# EAGLE schematic wristwatch (EAGLE 6.5.0)
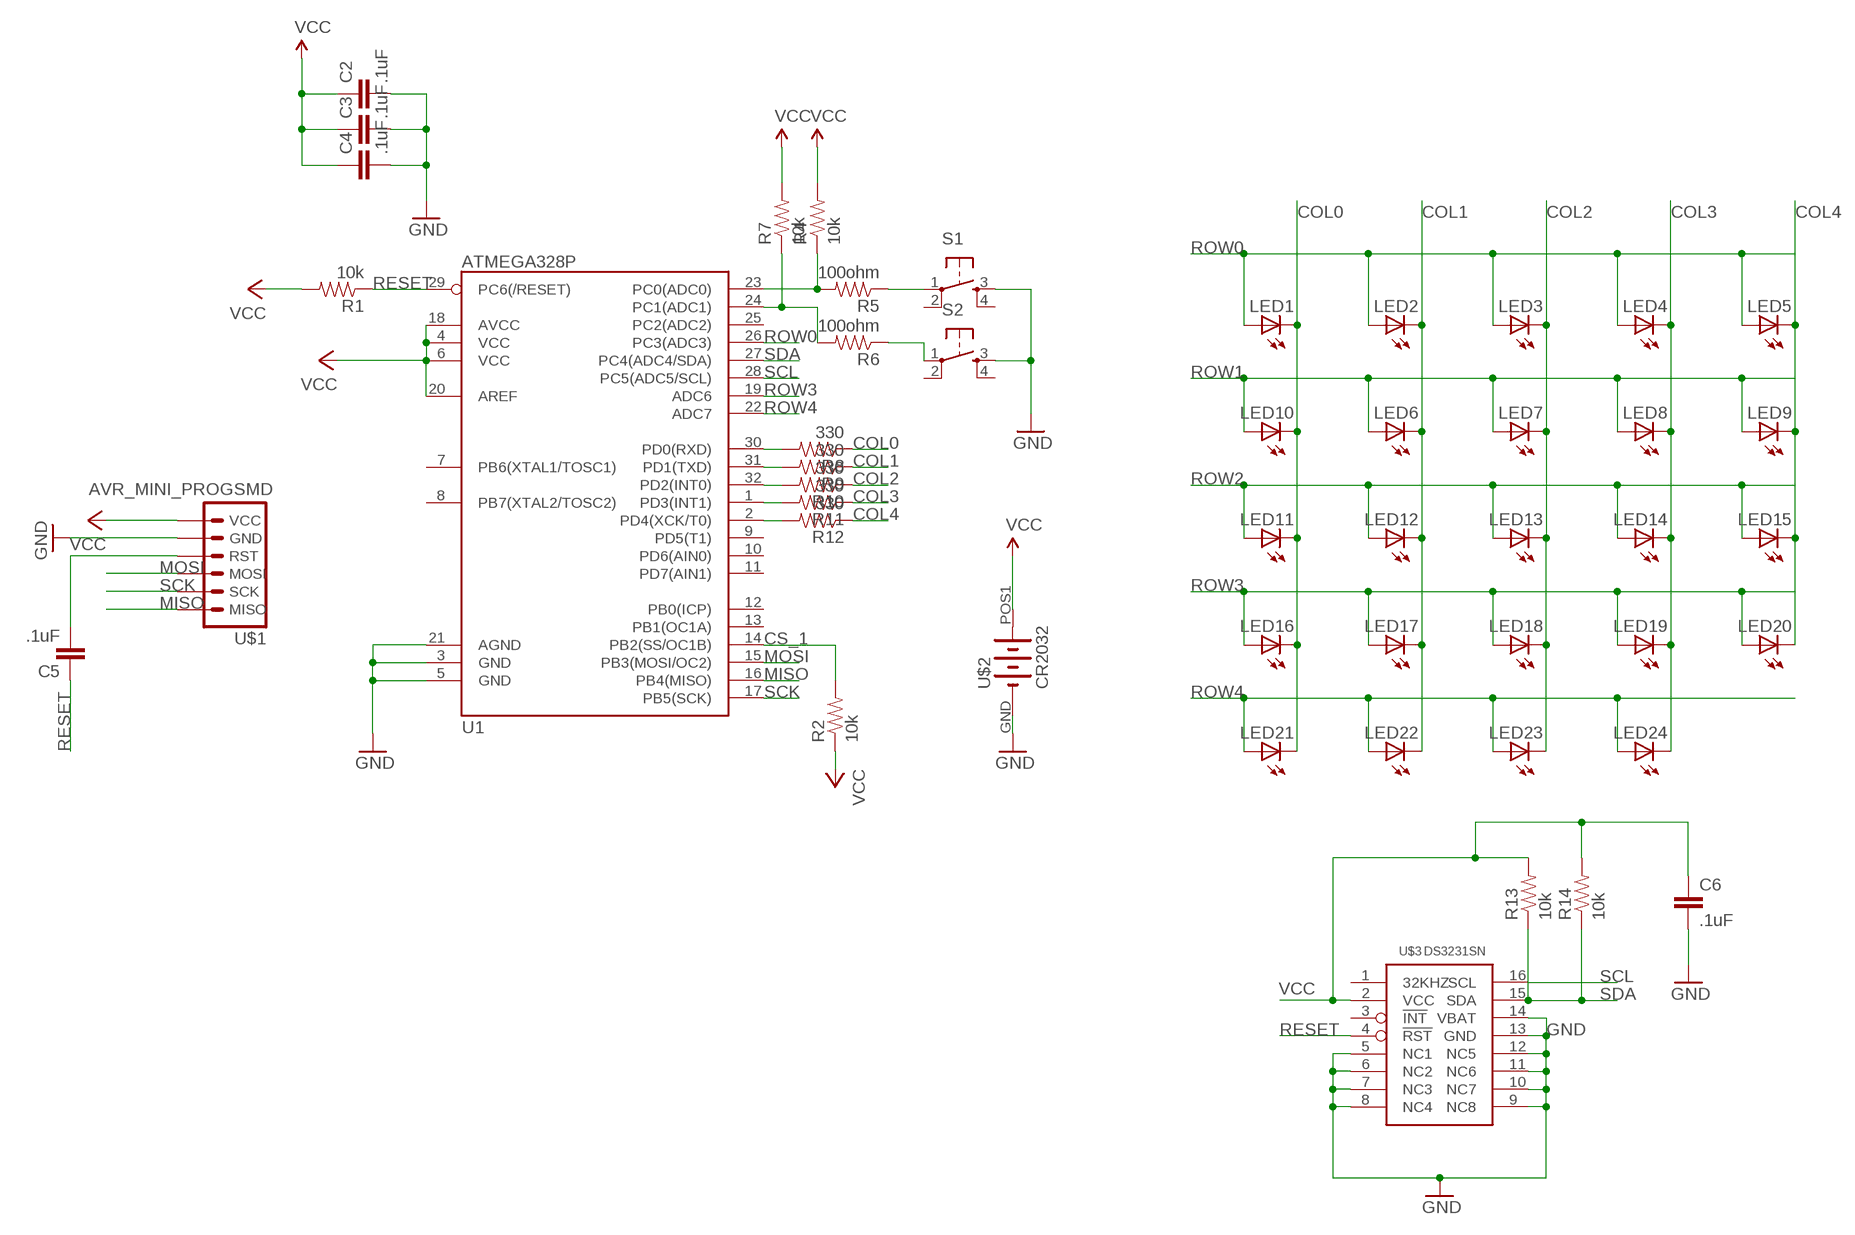
[diagram p0: schematic, sheet 1]

## Parts
C2  .1uF  CAP0805  [0805]
C3  .1uF  CAP0805  [0805]
C4  .1uF  CAP0805  [0805]
C5  .1uF  CAP0805  [0805]
C6  .1uF  CAP0805  [0805]
LED1  LEDCHIP-LED0805  [CHIP-LED0805]
LED2  LEDCHIP-LED0805  [CHIP-LED0805]
LED3  LEDCHIP-LED0805  [CHIP-LED0805]
LED4  LEDCHIP-LED0805  [CHIP-LED0805]
LED5  LEDCHIP-LED0805  [CHIP-LED0805]
LED6  LEDCHIP-LED0805  [CHIP-LED0805]
LED7  LEDCHIP-LED0805  [CHIP-LED0805]
LED8  LEDCHIP-LED0805  [CHIP-LED0805]
LED9  LEDCHIP-LED0805  [CHIP-LED0805]
LED10  LEDCHIP-LED0805  [CHIP-LED0805]
LED11  LEDCHIP-LED0805  [CHIP-LED0805]
LED12  LEDCHIP-LED0805  [CHIP-LED0805]
LED13  LEDCHIP-LED0805  [CHIP-LED0805]
LED14  LEDCHIP-LED0805  [CHIP-LED0805]
LED15  LEDCHIP-LED0805  [CHIP-LED0805]
LED16  LEDCHIP-LED0805  [CHIP-LED0805]
LED17  LEDCHIP-LED0805  [CHIP-LED0805]
LED18  LEDCHIP-LED0805  [CHIP-LED0805]
LED19  LEDCHIP-LED0805  [CHIP-LED0805]
LED20  LEDCHIP-LED0805  [CHIP-LED0805]
LED21  LEDCHIP-LED0805  [CHIP-LED0805]
LED22  LEDCHIP-LED0805  [CHIP-LED0805]
LED23  LEDCHIP-LED0805  [CHIP-LED0805]
LED24  LEDCHIP-LED0805  [CHIP-LED0805]
R1  10k  SPARKFUN_RESISTOR0805-RES  [SPARKFUN_0805]
R2  10k  SPARKFUN_RESISTOR0805-RES  [SPARKFUN_0805]
R4  10k  SPARKFUN_RESISTOR0805-RES  [SPARKFUN_0805]
R5  100ohm  SPARKFUN_RESISTOR0805-RES  [SPARKFUN_0805]
R6  100ohm  SPARKFUN_RESISTOR0805-RES  [SPARKFUN_0805]
R7  10k  SPARKFUN_RESISTOR0805-RES  [SPARKFUN_0805]
R8  330  SPARKFUN_RESISTOR0805-RES  [SPARKFUN_0805]
R9  330  SPARKFUN_RESISTOR0805-RES  [SPARKFUN_0805]
R10  330  SPARKFUN_RESISTOR0805-RES  [SPARKFUN_0805]
R11  330  SPARKFUN_RESISTOR0805-RES  [SPARKFUN_0805]
R12  330  SPARKFUN_RESISTOR0805-RES  [SPARKFUN_0805]
R13  10k  SPARKFUN_RESISTOR0805-RES  [SPARKFUN_0805]
R14  10k  SPARKFUN_RESISTOR0805-RES  [SPARKFUN_0805]
S1  TAC_SWITCHSMD  [TACTILE-SWITCH-SMD]
S2  TAC_SWITCHSMD  [TACTILE-SWITCH-SMD]
U1  ATMEGA328P  ATMEGA328_SMT  [TQFP32-08]
U$1  AVR_MINI_PROGSMD  [AVR_MINI_PROG]
U$2  CR2032  [CR2032-BAT-HLD]
U$3  DS3231SN  [SO16L]

## Nets
COL0: LED1.C LED10.C LED11.C LED16.C LED21.C R8.1
COL1: LED2.C LED6.C LED12.C LED17.C LED22.C R9.1
COL2: LED3.C LED7.C LED13.C LED18.C LED23.C R10.1
COL3: LED4.C LED8.C LED14.C LED19.C LED24.C R11.1
COL4: LED5.C LED9.C LED15.C LED20.C R12.1
CS_1: R2.2 U1.14(PB2(SS/OC1B))
GND: C2.2 C3.2 C4.2 C6.2 S1.3 S2.3 U1.3(GND) U1.5(GND) U1.21(AGND) U$1.2(GND) U$2.GND(-) U$3.5(NC1) U$3.6(NC2) U$3.7(NC3) U$3.8(NC4) U$3.9(NC8) U$3.10(NC7) U$3.11(NC6) U$3.12(NC5) U$3.13(GND) U$3.14(VBAT)
MISO: U1.16(PB4(MISO)) U$1.6(MISO)
MOSI: U1.15(PB3(MOSI/OC2)) U$1.4(MOSI)
N$1: C5.2 U$1.3(RST)
N$3: R4.1 R5.2 U1.23(PC0(ADC0))
N$4: R5.1 S1.1
N$5: R6.1 S2.1
N$6: R8.2 U1.30(PD0(RXD))
N$7: R6.2 R7.1 U1.24(PC1(ADC1))
N$8: R9.2 U1.31(PD1(TXD))
N$9: R10.2 U1.32(PD2(INT0))
N$10: R11.2 U1.1(PD3(INT1))
N$11: R12.2 U1.2(PD4(XCK/T0))
RESET: C5.1 R1.1 U1.29(PC6(/RESET)) U$3.4(!RST)
ROW0: LED1.A LED2.A LED3.A LED4.A LED5.A U1.26(PC3(ADC3))
ROW1: LED6.A LED7.A LED8.A LED9.A LED10.A
ROW2: LED11.A LED12.A LED13.A LED14.A LED15.A
ROW3: LED16.A LED17.A LED18.A LED19.A LED20.A U1.19(ADC6)
ROW4: LED21.A LED22.A LED23.A LED24.A U1.22(ADC7)
SCK: U1.17(PB5(SCK)) U$1.5(SCK)
SCL: U1.28(PC5(ADC5/SCL)) U$3.16(SCL)
SDA: R13.1 R14.1 U1.27(PC4(ADC4/SDA)) U$3.15(SDA)
VCC: C2.1 C3.1 C4.1 C6.1 R1.2 R2.1 R4.2 R7.2 R13.2 R14.2 U1.4(VCC) U1.6(VCC) U1.18(AVCC) U1.20(AREF) U$1.1(VCC) U$2.POS1(+) U$3.2(VCC)
Unconnected: S1.2 S1.4 S2.2 S2.4 U1.7(PB6(XTAL1/TOSC1)) U1.8(PB7(XTAL2/TOSC2)) U1.9(PD5(T1)) U1.10(PD6(AIN0)) U1.11(PD7(AIN1)) U1.12(PB0(ICP)) U1.13(PB1(OC1A)) U1.25(PC2(ADC2)) U$2.POS2(+) U$3.1(32KHZ) U$3.3(!INT)

## Library data of the parts
C2-C6 = SparkFun:CAP: Capacitor Standard 0603 ceramic capacitor, and 0.1" leaded capacitor.
LED1-LED24 = adafruit:LED: LED OSRAM: - CHIPLED LG R971, LG N971, LY N971, LG Q971, LY Q971, LO R971, LY R971 LH N974, LH R974 LS Q976, LO Q976, LY Q976 LO Q996 - Hyper CHIPLED LW Q18S LB Q993, LB Q99A, LB R99A - SideLED LS A670, LO A670, LY A670, LG A670, LP A670 LB A673, LV A673, LT A673, LW A673 LH A674 LY A675 LS A676, LA A676, LO A676, LY A676, LW A676 LS A679, LY A679, LG A679 - Hyper Micro SIDELED® LS Y876, LA Y876, LO Y876, LY Y876 LT Y87S - SmartLED LW L88C, LW L88S LB L89C, LB L89S, LG L890 LS L89K, LO L89K, LY L89K LS L896, LA L896, LO L896, LY L896 - TOPLED LS T670, LO T670, LY T670, LG T670, LP T670 LSG T670, LSP T670, LSY T670, LOP T670, LYG T670 LG T671, LOG T671, LSG T671 LB T673, LV T673, LT T673, LW T673 LH T674 LS T676, LA T676, LO T676, LY T676, LB T676, LH T676, LSB T676, LW T676 LB T67C, LV T67C, LT T67C, LS T67K, LO T67K, LY T67K, LW E67C LS E67B, LA E67B, LO E67B, LY E67B, LB E67C, LV E67C, LT E67C LW T67C LS T679, LY T679, LG T679 LS T770, LO T770, LY T770, LG T770, LP T770 LB T773, LV T773, LT T773, LW T773 LH T774 LS E675, LA E675, LY E675, LS T675 LS T776, LA T776, LO T776, LY T776, LB T776 LHGB T686 LT T68C, LB T68C - Hyper Mini TOPLED® LB M676 - Mini TOPLED Santana® LG M470 LS M47K, LO M47K, LY M47K Source: http://www.osram.convergy.de/
R1 R2 R4-R14 = DeadOn RTC - DS3234 Breakout-v11:SPARKFUN_RESISTOR: Resistor Basic schematic elements and footprints for 0603, 1206, and PTH resistors.
S1 S2 = SparkFun-Electromechanical:TAC_SWITCH: Momentary Switch Button commonly used for reset or general input. Spark Fun Electronics SKU : COM-00097 SMT- SWCH-08247
U1 = SparkFun-DigitalIC:ATMEGA328_SMT: 32-Pin Atmega328 part Commonly used on Arduino compatible boards Available in QFP and QFN packages TQFP is IC-09069 QFN is non-stock; PROD_ID: IC-09069
U$1 = SparkFun-Connectors:AVR_MINI_PROG: AVR ISP 6-pin inline header
U$2 = dale:CR2032: Surface mount cr2302 battery holder
U$3 = dale:DS3231SN: DS3231 Extremely Accurate I2C-Integrated RTC/TCXO/Crystal by Maxim